# Altium schematic sheet MCU - AUDIO.SchDoc
size A4; SheetNumber: 6; SheetTotal: 8
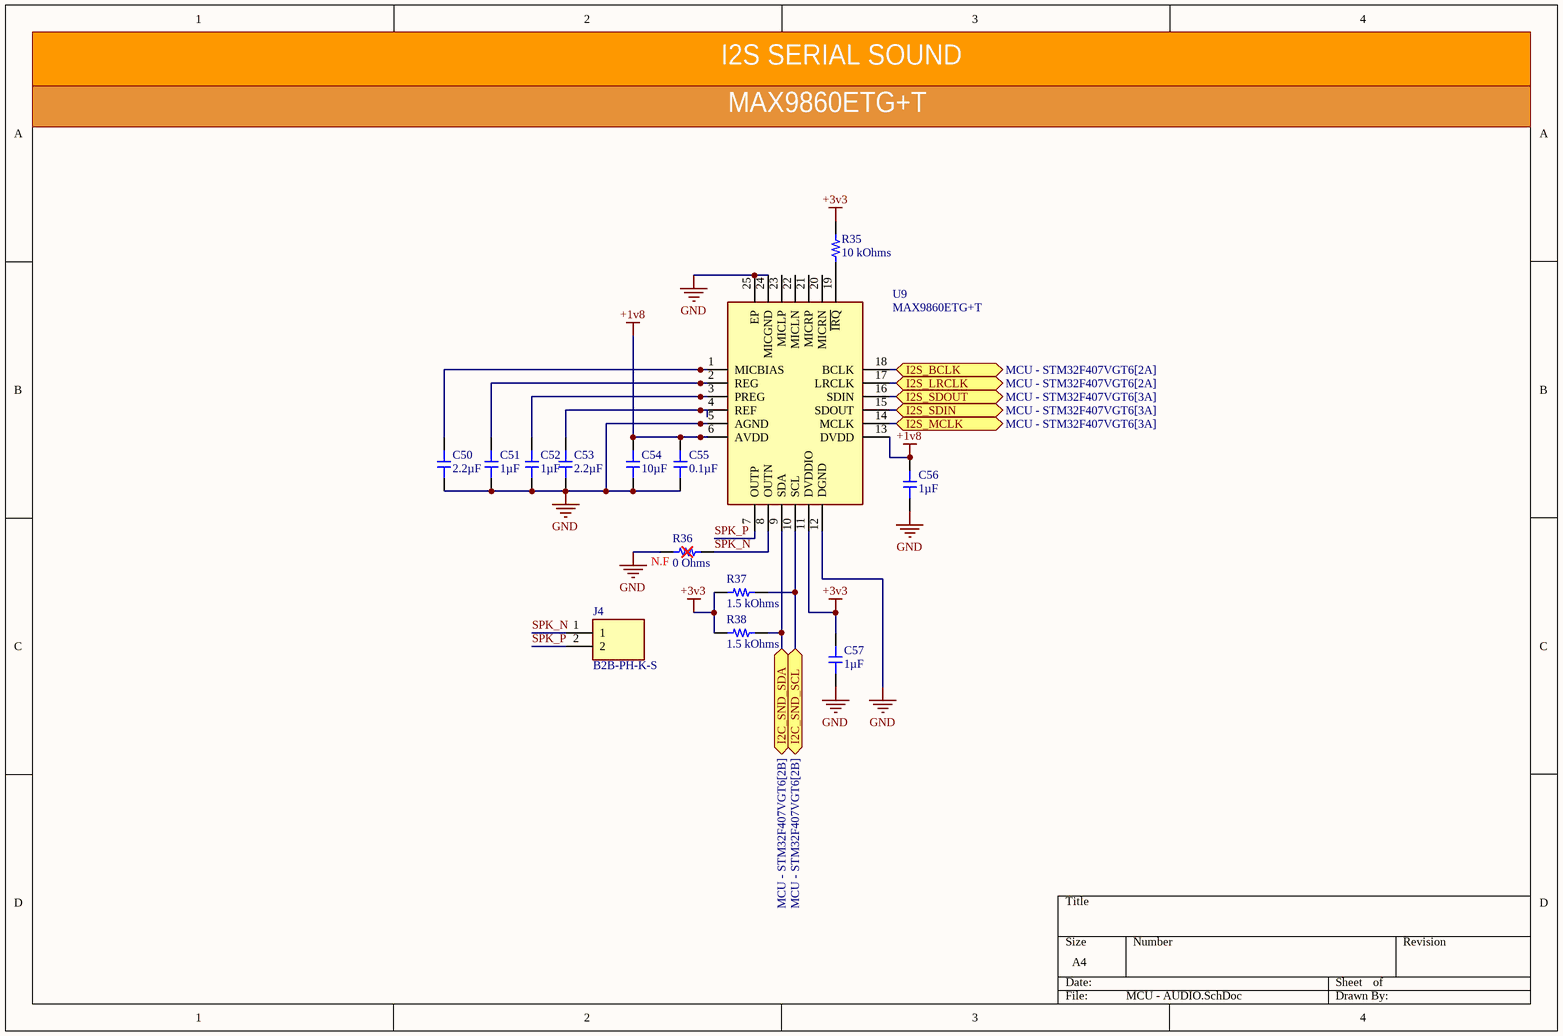
[diagram p0: MCU - AUDIO.SchDoc]

## Parts
C50  2.2µF  [0603_Footprint]
C51  1µF  [0603_Footprint]
C52  1µF  [0603_Footprint]
C53  2.2µF  [0603_Footprint]
C54  10µF  [0805]
C55  0.1µF  [0603_Footprint]
C56  1µF  [0603_Footprint]
C57  1µF  [0603_Footprint]
J4  B2B-PH-K-S  [JST_B2B-PH-K-S]
R35  10 kOhms  [0603_RES]
R36  0 Ohms  [0603_RES]
R37  1.5 kOhms  [0603_RES]
R38  1.5 kOhms  [0603_RES]
U9  MAX9860ETG+T  [QFN50P400X400X80-25N]

## Ports
I2C_SND_SCL (bidir, see MCU - STM32F407VGT6[2B]), I2C_SND_SDA (bidir, see MCU - STM32F407VGT6[2B]), I2S_BCLK (bidir, see MCU - STM32F407VGT6[2A]), I2S_LRCLK (bidir, see MCU - STM32F407VGT6[2A]), I2S_MCLK (bidir, see MCU - STM32F407VGT6[3A]), I2S_SDIN (bidir, see MCU - STM32F407VGT6[3A]), I2S_SDOUT (bidir, see MCU - STM32F407VGT6[3A])

## Nets
+1v8: C54.1 C55.1 C56.1 U9.6(AVDD) U9.13(DVDD)
+3v3: C57.1 R35.2 R37.1 R38.1 U9.11(DVDDIO)
GND: C50.1 C51.2 C52.2 C53.1 C54.2 C55.2 C56.2 C57.2 R36.1 U9.5(AGND) U9.12(DGND) U9.24(MICGND) U9.25(EP)
I2C_SND_SCL: R37.2 U9.10(SCL) ; port I2C_SND_SCL
I2C_SND_SDA: R38.2 U9.9(SDA) ; port I2C_SND_SDA
I2S_BCLK: U9.18(BCLK) ; port I2S_BCLK
I2S_LRCLK: U9.17(LRCLK) ; port I2S_LRCLK
I2S_MCLK: U9.14(MCLK) ; port I2S_MCLK
I2S_SDIN: U9.15(SDOUT) ; port I2S_SDIN
I2S_SDOUT: U9.16(SDIN) ; port I2S_SDOUT
SPK_N: J4.1 R36.2 U9.8(OUTN)
SPK_P: J4.2 U9.7(OUTP)
NetC50_2: C50.2 U9.1(MICBIAS)
NetC51_1: C51.1 U9.2(REG)
NetC52_1: C52.1 U9.3(PREG)
NetC53_2: C53.2 U9.4(REF)
NetR35_1: R35.1 U9.19(~{IRQ})

Not connected (* = marked no-connect by the designer): U9 20(MICRN) 21(MICRP) 22(MICLN) 23(MICLP)

## Notes on the sheet
- I2S SERIAL SOUND
- MAX9860ETG+T
- (near R36) N.F

## Library data of the parts
C50 C53 = 2.2uF 0603 Surface Capacitor
C51 C52 C56 C57 = 1uF 0603 Surface Capacitor
C54 = 10uF 0805 Surface Capacitor
C55 = 0.1uF 0603 Surface Capacitor_1_1_1_1_1_1: 0.1uF 0603 Surface Capacitor
J4 = B2B-PH-K-S: Connector Header Through Hole 2 position 0.079 (2.00mm); MF: JST Sales America Inc.; SnapEDA_Link: https://www.snapeda.com/parts/B2B-PH-K-S/JST/view-part/?ref=snap; Package: None; Value: *; MP: B2B-PH-K-S; Check_prices: https://www.snapeda.com/parts/B2B-PH-K-S/JST/view-part/?ref=eda
R35 = 10 kOhms 0603
R36 = 0 Ohm 0603
R37 R38 = 1.5 kOhms 0603
U9 = MAX9860ETG+T: Integrated Circuit; Manufacturer_Name: Analog Devices; Datasheet Link: https://datasheets.maximintegrated.com/en/ds/MAX9860.pdf; Height: 0.8mm; Manufacturer_Part_Number: MAX9860ETG+T; Mouser Part Number: 700-MAX9860ETGT; Mouser Price/Stock: https://www.mouser.co.uk/ProductDetail/Analog-Devices-Maxim-Integrated/MAX9860ETG%2bT?qs=LHmEVA8xxfYGy2Ln2j7A4Q%3D%3D; Arrow Part Number: MAX9860ETG+T; Arrow Price/Stock: https://www.arrow.com/en/products/max9860etgt/maxim-integrated?region=nac